# Altium project Hitachi _CD_IFI4.PrjPcb
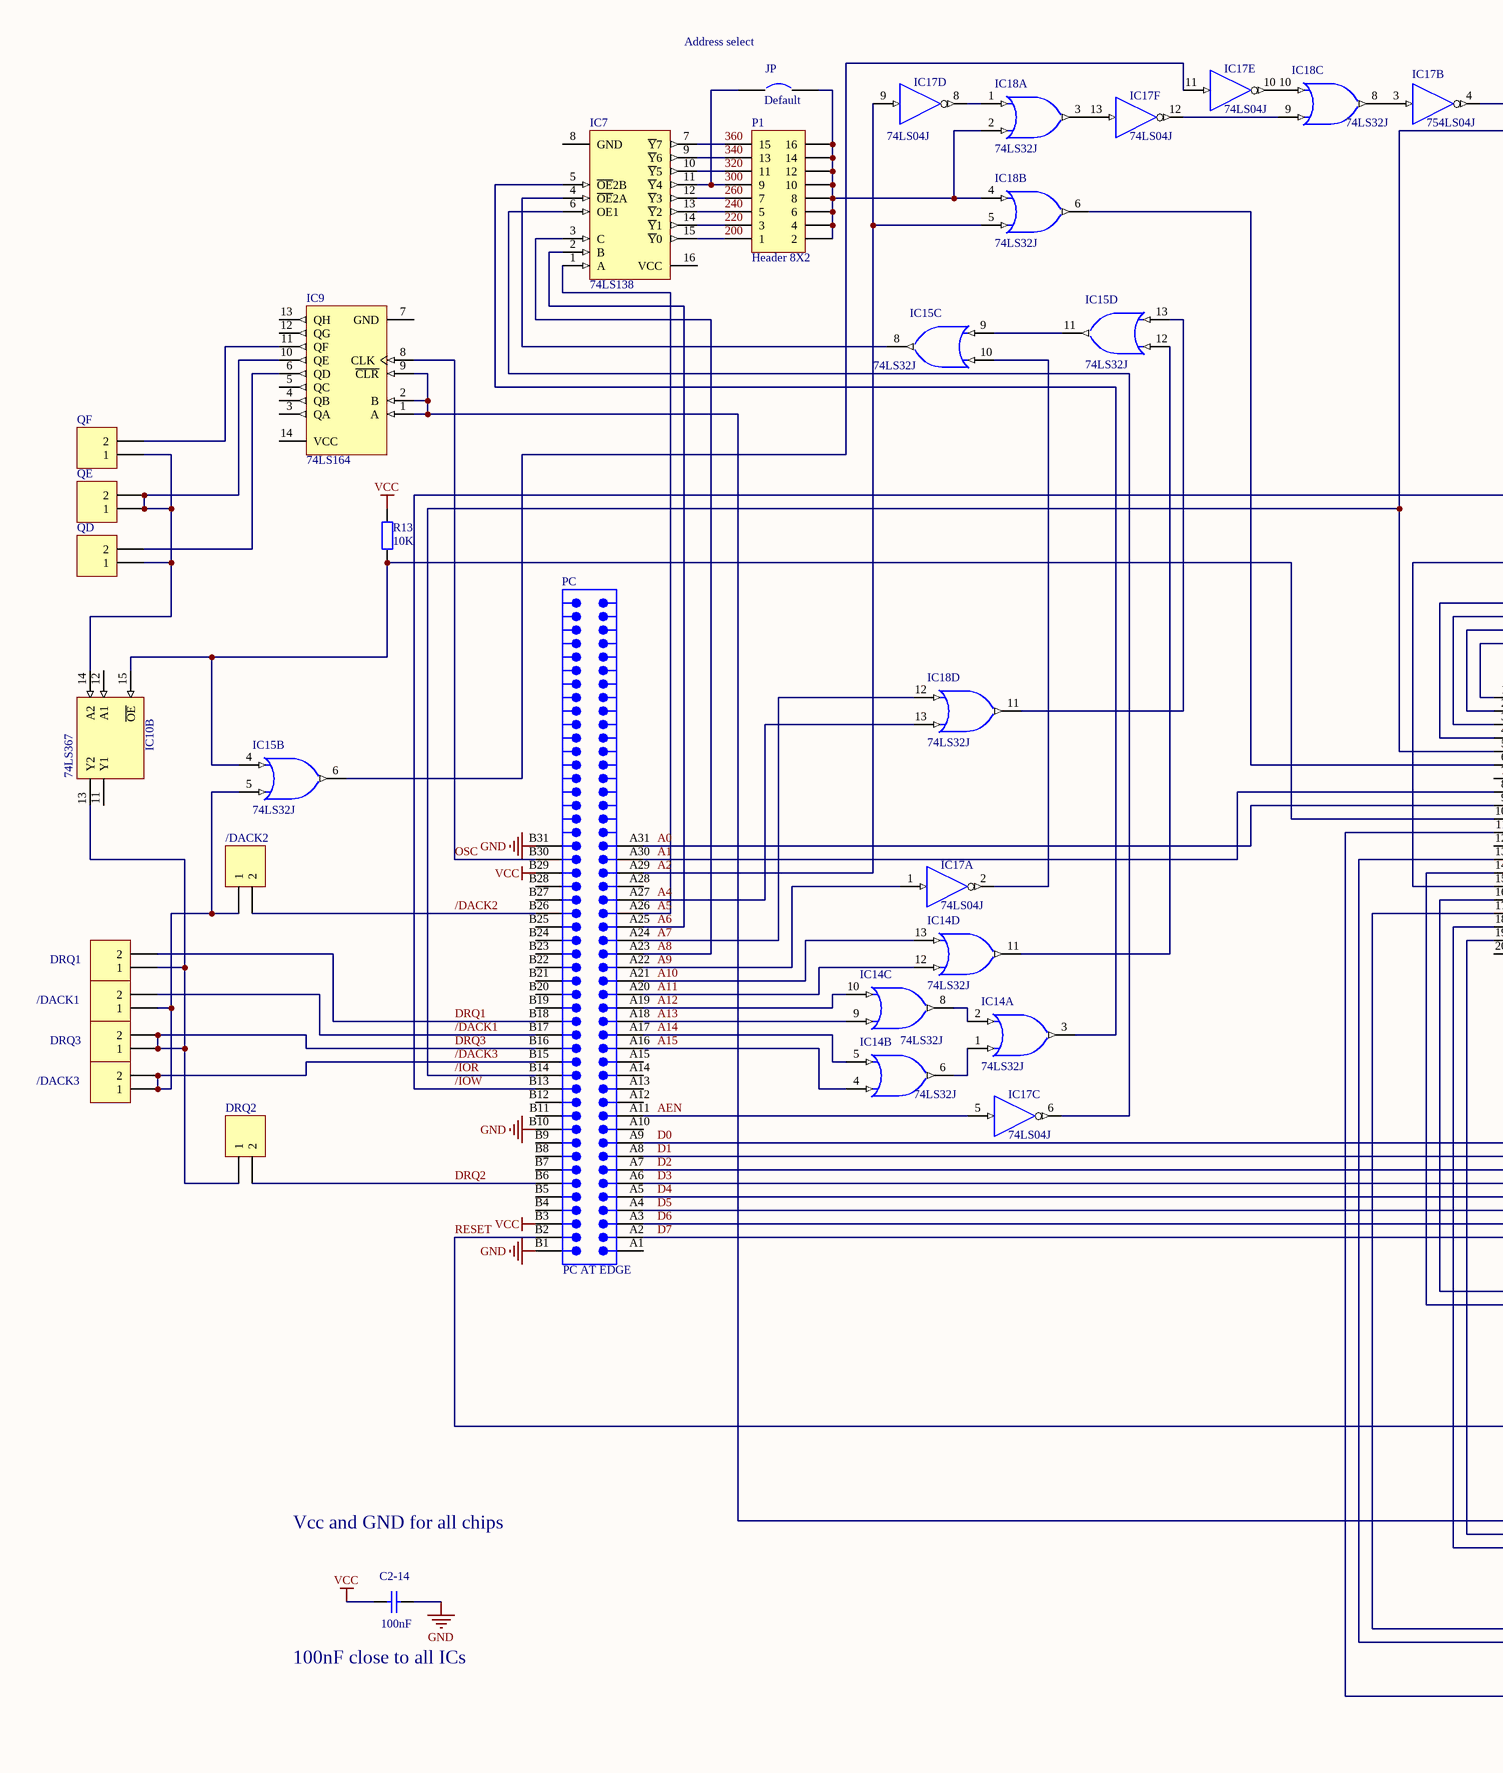
[diagram p0: AT short bus ( 7 x 4.2 inches).schdoc, left]
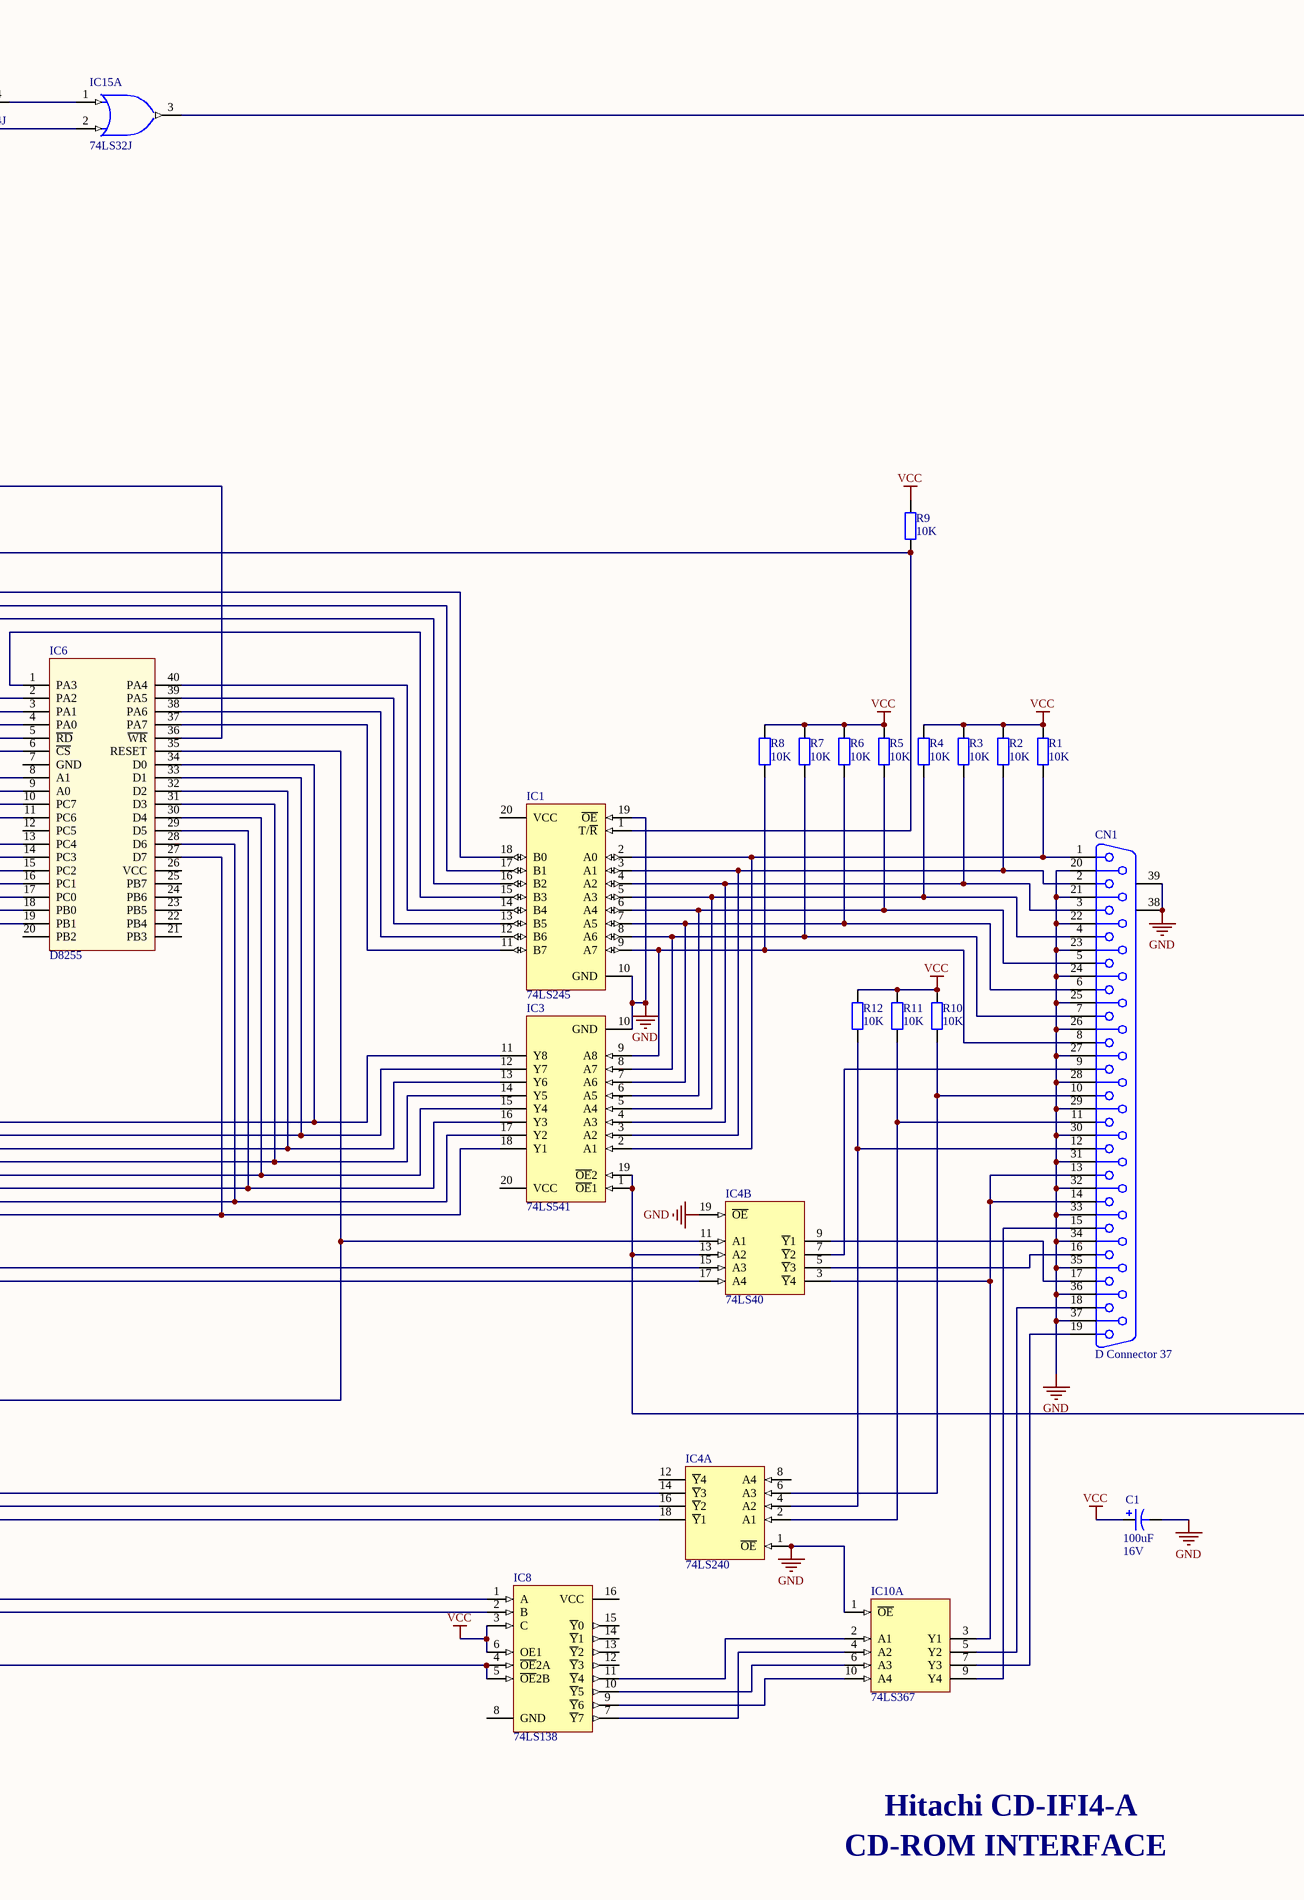
[diagram p1: AT short bus ( 7 x 4.2 inches).schdoc, right]
1 sheet, 40 parts. Net scope: global (net labels, ports and power ports of the same name join across sheets).
Board file: AT short bus ( 7 x 4.2 inches).PCBDOC

## Sheet AT short bus ( 7 x 4.2 inches).schdoc: AT short bus ( 7 x 4.2 inches)
size A2; Organization: Organization; Address1: Address1; Address2: Address2; Address3: Address3; Address4: Address4; DocumentNumber: 1; Revision: 0; SheetNumber: 2; SheetTotal: 2

### Parts
/DACK1  Header 2  [HDR1X2]  (value not drawn)
/DACK2  Header 2  [HDR1X2]  (value not drawn)
/DACK3  Header 2  [HDR1X2]  (value not drawn)
C1  value 100uF  Voltage: 16V  [RB7.6-15]  (hidden comment: Cap Pol1)
C2-14  value 100nF  [RAD-0.3]  (hidden comment: Cap)
CN1  D Connector 37  [DSUB37A]
DRQ1  Header 2  [HDR1X2]  (value not drawn)
DRQ2  Header 2  [HDR1X2]  (value not drawn)
DRQ3  Header 2  [HDR1X2]  (value not drawn)
IC1  74LS245  [DIP20]
IC3  74LS541  [DIP20]
IC4  74LS240  [DIP20]  (parts A,B of 2)
IC6  D8255  [PDIP40]
IC7  74LS138  [DIP16]
IC8  74LS138  [DIP16]
IC9  74LS164  [N014]
IC10  74LS367  [DIP16]  (parts A,B of 2)
IC14  74LS32J  [J014]  (parts A,B,C,D of 4)
IC15  74LS32J  [J014]  (parts A,B,C,D of 4)
IC17  74LS04J  [J014]  (parts A,B,C,D,E,F of 6)
IC18  74LS32J  [J014]  (parts A,B,C,D of 4)
JP  Default  [SPST-2]
P1  Header 8X2  [HDR2X8]
PC  PC AT EDGE  [PCATEDGE]
QD  Header 2  [HDR1X2]  (value not drawn)
QE  Header 2  [HDR1X2]  (value not drawn)
QF  Header 2  [HDR1X2]  (value not drawn)
R1  value 10K  [AXIAL-0.4]  (hidden comment: Res2)
R2  value 10K  [AXIAL-0.4]  (hidden comment: Res2)
R3  value 10K  [AXIAL-0.4]  (hidden comment: Res2)
R4  value 10K  [AXIAL-0.4]  (hidden comment: Res2)
R5  value 10K  [AXIAL-0.4]  (hidden comment: Res2)
R6  value 10K  [AXIAL-0.4]  (hidden comment: Res2)
R7  value 10K  [AXIAL-0.4]  (hidden comment: Res2)
R8  value 10K  [AXIAL-0.4]  (hidden comment: Res2)
R9  value 10K  [AXIAL-0.4]  (hidden comment: Res2)
R10  value 10K  [AXIAL-0.4]  (hidden comment: Res2)
R11  value 10K  [AXIAL-0.4]  (hidden comment: Res2)
R12  value 10K  [AXIAL-0.4]  (hidden comment: Res2)
R13  value 10K  [AXIAL-0.4]  (hidden comment: Res2)

### Nets
GND: C1.2 C2-14.2 CN1.20 CN1.21 CN1.22 CN1.23 CN1.24 CN1.25 CN1.26 CN1.27 CN1.28 CN1.29 CN1.30 CN1.31 CN1.32 CN1.33 CN1.34 CN1.35 CN1.36 CN1.37 CN1.38(MH1) CN1.39(MH2) IC1.10(GND) IC1.19(~{OE}) IC3.10(GND) IC4.1(~{OE}) IC4.10(GND) IC4.19(~{OE}) IC10.1(~{OE}) IC10.8(GND) IC14.7(GND) IC15.7(GND) IC17.7(GND) IC18.7(GND) PC.B1 PC.B10 PC.B31
VCC: C1.1 C2-14.1 IC4.20(VCC) IC8.3(C) IC8.6(OE1) IC10.16(VCC) IC14.14(VCC) IC15.14(VCC) IC17.14(VCC) IC18.14(VCC) PC.B3 PC.B29 R1.1 R2.2 R3.2 R4.2 R5.2 R6.2 R7.2 R8.2 R9.1 R10.2 R11.2 R12.2 R13.2
200: IC7.15(~{Y}0) P1.1
220: IC7.14(~{Y}1) P1.3
240: IC7.13(~{Y}2) P1.5
260: IC7.12(~{Y}3) P1.7
300: IC7.11(~{Y}4) JP.1 P1.9
320: IC7.10(~{Y}5) P1.11
340: IC7.9(~{Y}6) P1.13
360: IC7.7(~{Y}7) P1.15
/DACK1: /DACK1.2 PC.B17
/DACK2: /DACK2.2 PC.B26
/DACK3: /DACK1.1 /DACK2.1 /DACK3.1 /DACK3.2 IC15.5(B) PC.B15
/IOR: IC6.5(~{RD}) IC15.2(B) PC.B14
/IOW: IC6.36(~{WR}) PC.B13
A0: IC6.9(A0) PC.A31
A1: IC6.8(A1) PC.A30
A2: IC17.9(A) IC18.5(B) PC.A29
A4: IC18.13(B) PC.A27
A5: IC7.1(A) PC.A26
A6: IC7.2(B) PC.A25
A7: IC18.12(A) PC.A24
A8: IC7.3(C) PC.A23
A9: IC17.1(A) PC.A22
A10: IC14.13(B) PC.A21
A11: IC14.12(A) PC.A20
A12: IC14.10(B) PC.A19
A13: IC14.9(A) PC.A18
A14: IC14.5(B) PC.A17
A15: IC14.4(A) PC.A16
AEN: IC17.5(A) PC.A11
D0: IC3.11(Y8) IC6.34(D0) PC.A9
D1: IC3.12(Y7) IC6.33(D1) PC.A8
D2: IC3.13(Y6) IC6.32(D2) PC.A7
D3: IC3.14(Y5) IC6.31(D3) PC.A6
D4: IC3.15(Y4) IC6.30(D4) PC.A5
D5: IC3.16(Y3) IC6.29(D5) PC.A4
D6: IC3.17(Y2) IC6.28(D6) PC.A3
D7: IC3.18(Y1) IC6.27(D7) PC.A2
DRQ1: DRQ1.2 PC.B18
DRQ2: DRQ2.2 PC.B6
DRQ3: DRQ1.1 DRQ2.1 DRQ3.1 DRQ3.2 IC10.13(Y2) PC.B16
OSC: IC9.8(CLK) PC.B30
RESET: IC4.11(A1) IC6.35(RESET) PC.B2
NetCN1_1: CN1.1 IC1.2(A0) IC3.2(A1) R1.2
NetCN1_2: CN1.2 IC1.3(A1) IC3.3(A2) R2.1
NetCN1_3: CN1.3 IC1.4(A2) IC3.4(A3) R3.1
NetCN1_4: CN1.4 IC1.5(A3) IC3.5(A4) R4.1
NetCN1_5: CN1.5 IC1.6(A4) IC3.6(A5) R5.1
NetCN1_6: CN1.6 IC1.7(A5) IC3.7(A6) R6.1
NetCN1_7: CN1.7 IC1.8(A6) IC3.8(A7) R7.1
NetCN1_8: CN1.8 IC1.9(A7) IC3.9(A8) R8.1
NetCN1_9: CN1.9 IC4.7(~{Y}2)
NetCN1_10: CN1.10 IC4.6(A3) R10.1
NetCN1_11: CN1.11 IC4.2(A1) R11.1
NetCN1_12: CN1.12 IC4.4(A2) R12.1
NetCN1_13: CN1.13 CN1.14 IC4.3(~{Y}4) IC10.3(Y1)
NetCN1_15: CN1.15 IC10.9(Y4)
NetCN1_16: CN1.16 IC4.5(~{Y}3)
NetCN1_17: CN1.17 IC4.9(~{Y}1)
NetCN1_18: CN1.18 IC10.5(Y2)
NetCN1_19: CN1.19 IC10.7(Y3)
NetIC1_1: IC1.1(T/~{R}) IC6.15(PC2) R9.2
NetIC1_11: IC1.11(B7) IC6.37(PA7)
NetIC1_12: IC1.12(B6) IC6.38(PA6)
NetIC1_13: IC1.13(B5) IC6.39(PA5)
NetIC1_14: IC1.14(B4) IC6.40(PA4)
NetIC1_15: IC1.15(B3) IC6.1(PA3)
NetIC1_16: IC1.16(B2) IC6.2(PA2)
NetIC1_17: IC1.17(B1) IC6.3(PA1)
NetIC1_18: IC1.18(B0) IC6.4(PA0)
NetIC3_1: IC3.1(~{OE}1) IC3.19(~{OE}2) IC4.13(A2) IC15.3(Y)
NetIC4_14: IC4.14(~{Y}3) IC9.1(A) IC9.2(B) IC9.9(~{CLR})
NetIC4_15: IC4.15(A3) IC6.16(PC1)
NetIC4_16: IC4.16(~{Y}2) IC6.19(PB1)
NetIC4_17: IC4.17(A4) IC6.14(PC3)
NetIC4_18: IC4.18(~{Y}1) IC6.18(PB0)
NetIC6_6: IC6.6(~{CS}) IC18.6(Y)
NetIC6_10: IC6.10(PC7) IC10.15(~{OE}) IC15.4(A) R13.1
NetIC6_11: IC6.11(PC6) IC8.4(~{OE}2A) IC8.5(~{OE}2B)
NetIC6_13: IC6.13(PC4) IC8.2(B)
NetIC6_17: IC6.17(PC0) IC8.1(A)
NetIC7_4: IC7.4(~{OE}2A) IC15.8(Y)
NetIC7_5: IC7.5(~{OE}2B) IC14.3(Y)
NetIC7_6: IC7.6(OE1) IC17.6(Y)
NetIC8_7: IC8.7(~{Y}7) IC10.4(A2)
NetIC8_9: IC8.9(~{Y}6) IC10.10(A4)
NetIC8_10: IC8.10(~{Y}5) IC10.6(A3)
NetIC8_11: IC8.11(~{Y}4) IC10.2(A1)
NetIC9_6: IC9.6(QD) QD.2
NetIC9_10: IC9.10(QE) IC10.14(A2) QD.1 QE.1 QE.2 QF.1
NetIC9_11: IC9.11(QF) QF.2
NetIC14_1: IC14.1(A) IC14.6(Y)
NetIC14_2: IC14.2(B) IC14.8(Y)
NetIC14_11: IC14.11(Y) IC15.12(A)
NetIC15_1: IC15.1(A) IC17.4(Y)
NetIC15_6: IC15.6(Y) IC17.11(A)
NetIC15_9: IC15.9(A) IC15.11(Y)
NetIC15_10: IC15.10(B) IC17.2(Y)
NetIC15_13: IC15.13(B) IC18.11(Y)
NetIC17_3: IC17.3(A) IC18.8(Y)
NetIC17_8: IC17.8(Y) IC18.1(A)
NetIC17_10: IC17.10(Y) IC18.10(B)
NetIC17_12: IC17.12(Y) IC18.9(A)
NetIC17_13: IC17.13(A) IC18.3(Y)
NetIC18_2: IC18.2(B) IC18.4(A) JP.2 P1.2 P1.4 P1.6 P1.8 P1.10 P1.12 P1.14 P1.16

Not connected (* = marked no-connect by the designer): IC1 20(VCC); IC3 20(VCC); IC4 8(A4) 12(~{Y}4); IC6 7(GND) 12(PC5) 20(PB2) 21(PB3) 22(PB4) 23(PB5) 24(PB6) 25(PB7) 26(VCC); IC7 8(GND) 16(VCC); IC8 8(GND) 12(~{Y}3) 13(~{Y}2) 14(~{Y}1) 15(~{Y}0) 16(VCC); IC9 3(QA) 4(QB) 5(QC) 7(GND) 12(QG) 13(QH) 14(VCC); IC10 11(Y1) 12(A1); PC A1 A10 A12 A13 A14 A15 A28 B4 B5 B7 B8 B9 B11 B12 B19 B20 B21 B22 B23 B24 B25 B27 B28 C1 C2 C3 C4 C5 C6 C7 C8 C9 C10 C11 C12 C13 C14 C15 C16 C17 C18 D1 D2 D3 D4 D5 D6 D7 D8 D9 D10 D11 D12 D13 D14 D15 D16 D17 D18

### Notes on the sheet
- (near JP) Address select
- Vcc and GND for all chips
- (near C2-14) 100nF close to all ICs
- Hitachi CD-IFI4-A
- CD-ROM INTERFACE

### Library data of the parts
/DACK1-/DACK3 DRQ1-DRQ3 QD QE QF = Header 2: Header, 2-Pin; LatestRevisionDate: 17-Jul-2002; LatestRevisionNote: Re-released for DXP Platform.; Publisher: Altium Limited
C1 = Cap Pol1: Polarized Capacitor (Radial); Published: 8-Jun-2000; LatestRevisionDate: 17-Jul-2002; LatestRevisionNote: Re-released for DXP Platform.; PackageReference: RB7.6-15; Publisher: Altium Limited; PackageDescription: Polarized Capacitor (Radial); 2 Leads
C2-14 = Cap: Capacitor; Published: 8-Jun-2000; LatestRevisionDate: 17-Jul-2002; LatestRevisionNote: Re-released for DXP Platform.; PackageReference: RAD-0.3; Publisher: Altium Limited; PackageDescription: Radial Cap, Thru-Hole; 2 Leads; 0.3 in Pin Spacing
CN1 = D Connector 37: Receptacle Assembly, 37 Position, Right Angle; Positions: 37; Orientation: Right Angle; Gender: Receptacle
IC1 = M74HCT245B1R: Octal Bus Transceiver 3-State Non-Inverting; Published: 8-Jun-2000; LatestRevisionDate: 06-Jun-2005; LatestRevisionNote: Stylized 3D Model Added.; DatasheetVersion: Oct-1993; PackageVersion: Jun-1998; PackageReference: DIP20; Publisher: Altium Limited; PackageDescription: DIP; 20 Leads; Row Spacing 7.62 mm; Pitch 2.54 mm; Code_JEDEC: MS-015-AE; ComponentLink1Description: Manufacturer Link; ComponentLink1URL: http://www.st.com/; ComponentLink2Description: Datasheet; ComponentLink2URL: http://www.st.com/stonline/products/literature/ds/2114/m74hct245.pdf
IC3 = M74HCT541B1R: Octal Bus Buffer with 3 State Outputs (Non Inverted); Published: 8-Jun-2000; LatestRevisionDate: 06-Jun-2005; LatestRevisionNote: Stylized 3D Model Added.; DatasheetVersion: Oct-1993; PackageVersion: Jun-1998; PackageReference: DIP20; Publisher: Altium Limited; PackageDescription: DIP; 20 Leads; Row Spacing 7.62 mm; Pitch 2.54 mm; Code_JEDEC: MS-015-AE; ComponentLink1Description: Manufacturer Link; ComponentLink1URL: http://www.st.com/; ComponentLink2Description: Datasheet; ComponentLink2URL: http://www.st.com/stonline/products/literature/ds/8031/m74hct541.pdf
IC4 = M74HCT240PUB1R: Octal Bus Buffer with Pull-Up Input Network; Published: 8-Jun-2000; LatestRevisionDate: 06-Jun-2005; LatestRevisionNote: Stylized 3D Model Added.; DatasheetVersion: 1994; PackageVersion: Jun-1998; PackageReference: DIP20; Publisher: Altium Limited; PackageDescription: DIP; 20 Leads; Row Spacing 7.62 mm; Pitch 2.54 mm; Code_JEDEC: MS-015-AE; ComponentLink1Description: Manufacturer Link; ComponentLink1URL: http://www.st.com/
IC6 = D8255 interface: programmable pheripherial interface
IC7 IC8 = M74HCT138B1R: 3-to-8 Line Decoder Inverting; Published: 8-Jun-2000; LatestRevisionDate: 06-Jun-2005; LatestRevisionNote: Stylized 3D Model Added.; DatasheetVersion: Feb-1993; PackageVersion: Apr-1996; PackageReference: DIP16; Publisher: Altium Limited; PackageDescription: DIP; 16 Leads; Row Spacing 7.62 mm; Pitch 2.54 mm; ComponentLink1Description: Manufacturer Link; ComponentLink1URL: http://www.st.com/; ComponentLink2Description: Datasheet; ComponentLink2URL: http://www.st.com/stonline/products/literature/ds/2104/m74hct138.pdf
IC9 = SN74LS164N: 8-Bit Parallel-Out Serial Shift Register; Published: 8-Jun-2000; LatestRevisionDate: 04-Mar-2005; LatestRevisionNote: Stylized 3D Model Added.; DatasheetVersion: Mar-1988; PackageVersion: Oct-1995; PackageReference: N014; Publisher: Altium Limited; PackageDescription: DIP; 14 Leads; Row Spacing 7.62 mm; Pitch 2.54 mm; ComponentLink1Description: Manufacturer Link; ComponentLink1URL: http://www.ti.com/; ComponentLink2Description: Datasheet; ComponentLink2URL: http://www-s.ti.com/sc/ds/sn74164.pdf
IC10 = M74HCT367B1R: Hex Bus Buffer (3-State Non Inv.); Published: 8-Jun-2000; LatestRevisionDate: 06-Jun-2005; LatestRevisionNote: Stylized 3D Model Added.; DatasheetVersion: Feb-1993; PackageVersion: Apr-1996; PackageReference: DIP16; Publisher: Altium Limited; PackageDescription: DIP; 16 Leads; Row Spacing 7.62 mm; Pitch 2.54 mm; ComponentLink1Description: Manufacturer Link; ComponentLink1URL: http://www.st.com/
IC14 IC15 IC18 = SN54LS32J: Quadruple 2-Input Positive-OR Gate; Published: 8-Jun-2000; LatestRevisionDate: 04-Mar-2005; LatestRevisionNote: Stylized 3D Model Added.; DatasheetVersion: Mar-1988; PackageVersion: Jun-1999; PackageReference: J014; Publisher: Altium Limited; PackageDescription: DIP; 14 Leads; Row Spacing 7.62 mm; Pitch 2.54 mm; ComponentLink1Description: Manufacturer Link; ComponentLink1URL: http://www.ti.com/; ComponentLink2Description: Datasheet; ComponentLink2URL: http://www-s.ti.com/sc/ds/sn54ls32.pdf; ComponentLink3Description: Packaging Specification; ComponentLink3URL: http://focus.ti.com/lit/ml/mcer002d/mcer002d.pdf
IC17 = SN54LS04J: Hex Inverter; Published: 8-Jun-2000; LatestRevisionDate: 04-Mar-2005; LatestRevisionNote: Stylized 3D Model Added.; DatasheetVersion: Mar-1988; PackageVersion: Jun-1999; PackageReference: J014; Publisher: Altium Limited; PackageDescription: DIP; 14 Leads; Row Spacing 7.62 mm; Pitch 2.54 mm; ComponentLink1Description: Manufacturer Link; ComponentLink1URL: http://www.ti.com/; ComponentLink2Description: Datasheet; ComponentLink2URL: http://www-s.ti.com/sc/ds/sn5404.pdf; ComponentLink3Description: Packaging Specification; ComponentLink3URL: http://focus.ti.com/lit/ml/mcer002d/mcer002d.pdf
JP = Circuit Breaker: Published: 24-Mar-1999; LatestRevisionDate: 17-Jul-2002; LatestRevisionNote: Re-released for DXP Platform.; PackageReference: SPST-2; Publisher: Altium Limited; PackageDescription: Switch; 2 Leads
P1 = Header 8X2: Header, 8-Pin, Dual row; LatestRevisionDate: 17-Jul-2002; LatestRevisionNote: Re-released for DXP Platform.; Publisher: Altium Limited
PC = PCATEDGE: Card, 98-Position; Text Field6: Alternate Layout Available; Text Field7: Published 14-Feb-2002
R1-R13 = Res2: Resistor; Published: 8-Jun-2000; LatestRevisionDate: 17-Jul-2002; LatestRevisionNote: Re-released for DXP Platform.; PackageReference: AXIAL-0.4; Publisher: Altium Limited; PackageDescription: Axial Device, Thru-Hole; 2 Leads; 0.4 in Pin Spacing